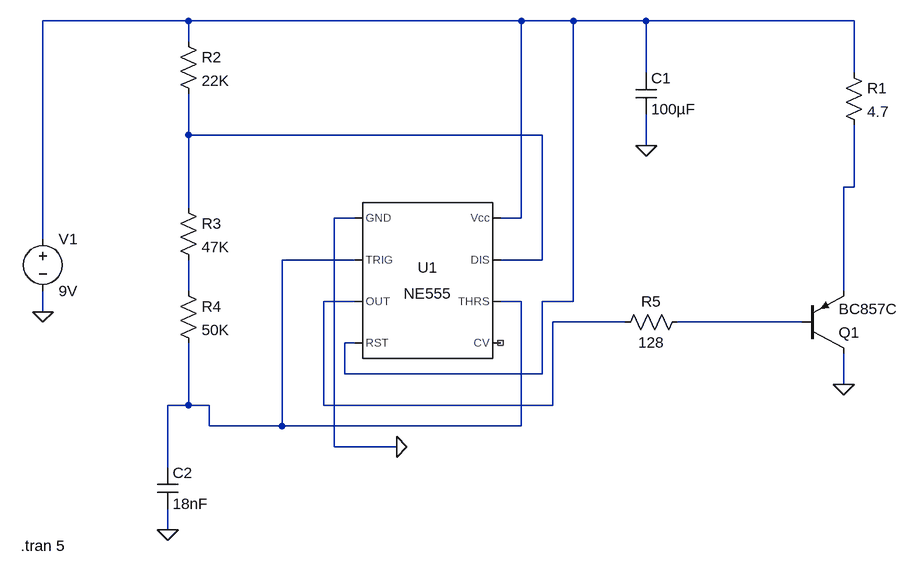
[diagram p0: schematic horn.asc]
horn.asc, the LTspice schematic file:
Version 4
SHEET 1 944 680
WIRE -176 -240 -400 -240
WIRE 336 -240 -176 -240
WIRE 416 -240 336 -240
WIRE 528 -240 416 -240
WIRE 848 -240 528 -240
WIRE -176 -208 -176 -240
WIRE 528 -160 528 -240
WIRE 848 -160 848 -240
WIRE -176 -64 -176 -128
WIRE 368 -64 -176 -64
WIRE 528 -48 528 -96
WIRE 848 16 848 -80
WIRE 848 16 832 16
WIRE -176 48 -176 -64
WIRE 80 64 48 64
WIRE 336 64 336 -240
WIRE 336 64 304 64
WIRE -400 96 -400 -240
WIRE 80 128 -32 128
WIRE 368 128 368 -64
WIRE 368 128 304 128
WIRE -176 176 -176 128
WIRE 832 176 832 16
WIRE 80 192 32 192
WIRE 336 192 304 192
WIRE 416 192 416 -240
WIRE 416 192 368 192
WIRE -400 208 -400 176
WIRE 496 224 384 224
WIRE 768 224 576 224
WIRE 80 256 64 256
WIRE 64 304 64 256
WIRE 368 304 368 192
WIRE 368 304 64 304
WIRE 832 320 832 272
WIRE -176 352 -176 256
WIRE -176 352 -208 352
WIRE -144 352 -176 352
WIRE 32 352 32 192
WIRE 384 352 384 224
WIRE 384 352 32 352
WIRE -144 384 -144 352
WIRE -32 384 -32 128
WIRE -32 384 -144 384
WIRE 336 384 336 192
WIRE 336 384 -32 384
WIRE 48 416 48 64
WIRE 144 416 48 416
WIRE -208 448 -208 352
WIRE -208 544 -208 512
FLAG 528 -48 0
FLAG -208 544 0
FLAG -400 208 0
FLAG 832 320 0
FLAG 144 416 0
SYMBOL Misc\\NE555 192 160 R0
SYMATTR InstName U1
SYMBOL res 832 -176 R0
SYMATTR InstName R1
SYMATTR Value 4.7
SYMBOL res -192 -224 R0
SYMATTR InstName R2
SYMATTR Value 22K
SYMBOL res -192 32 R0
SYMATTR InstName R3
SYMATTR Value 47K
SYMBOL res -192 160 R0
SYMATTR InstName R4
SYMATTR Value 50K
SYMBOL res 592 208 R90
WINDOW 0 0 56 VBottom 2
WINDOW 3 32 56 VTop 2
SYMATTR InstName R5
SYMATTR Value 128
SYMBOL cap 512 -160 R0
SYMATTR InstName C1
SYMATTR Value 100µF
SYMBOL cap -224 448 R0
SYMATTR InstName C2
SYMATTR Value 18nF
SYMBOL voltage -400 80 R0
WINDOW 123 0 0 Left 0
WINDOW 39 0 0 Left 0
SYMATTR InstName V1
SYMATTR Value 9V
SYMBOL pnp 768 272 M180
SYMATTR InstName Q1
SYMATTR Value BC857C
TEXT -434 568 Left 2 !.tran 5

The netlist it stands for:
* horn.asc
XU1 0 N004 N006 N001 NC_01 N004 N002 N001 NE555  ; pins GND TRIG OUT RST CV THRS DIS Vcc
R1 N001 N003 4.7
R2 N001 N002 22K
R3 N002 N005 47K
R4 N005 N004 50K
R5 N007 N006 128
C1 N001 0 100µF
C2 N004 0 18nF
V1 N001 0 9V
Q1 0 N007 N003 0 BC857C
.model NPN NPN
.model PNP PNP
.lib standard.bjt
.tran 5
.lib NE555.sub
.backanno
.end